# Altium schematic sheet ZIF_Bridge.SchDoc: Ribbon Bridge
size A4; Organization: Altium Limited; Address1: L3, 12a Rodborough Rd; Address2: Frenchs Forest; Address3: NSW; Address4: Australia 2086
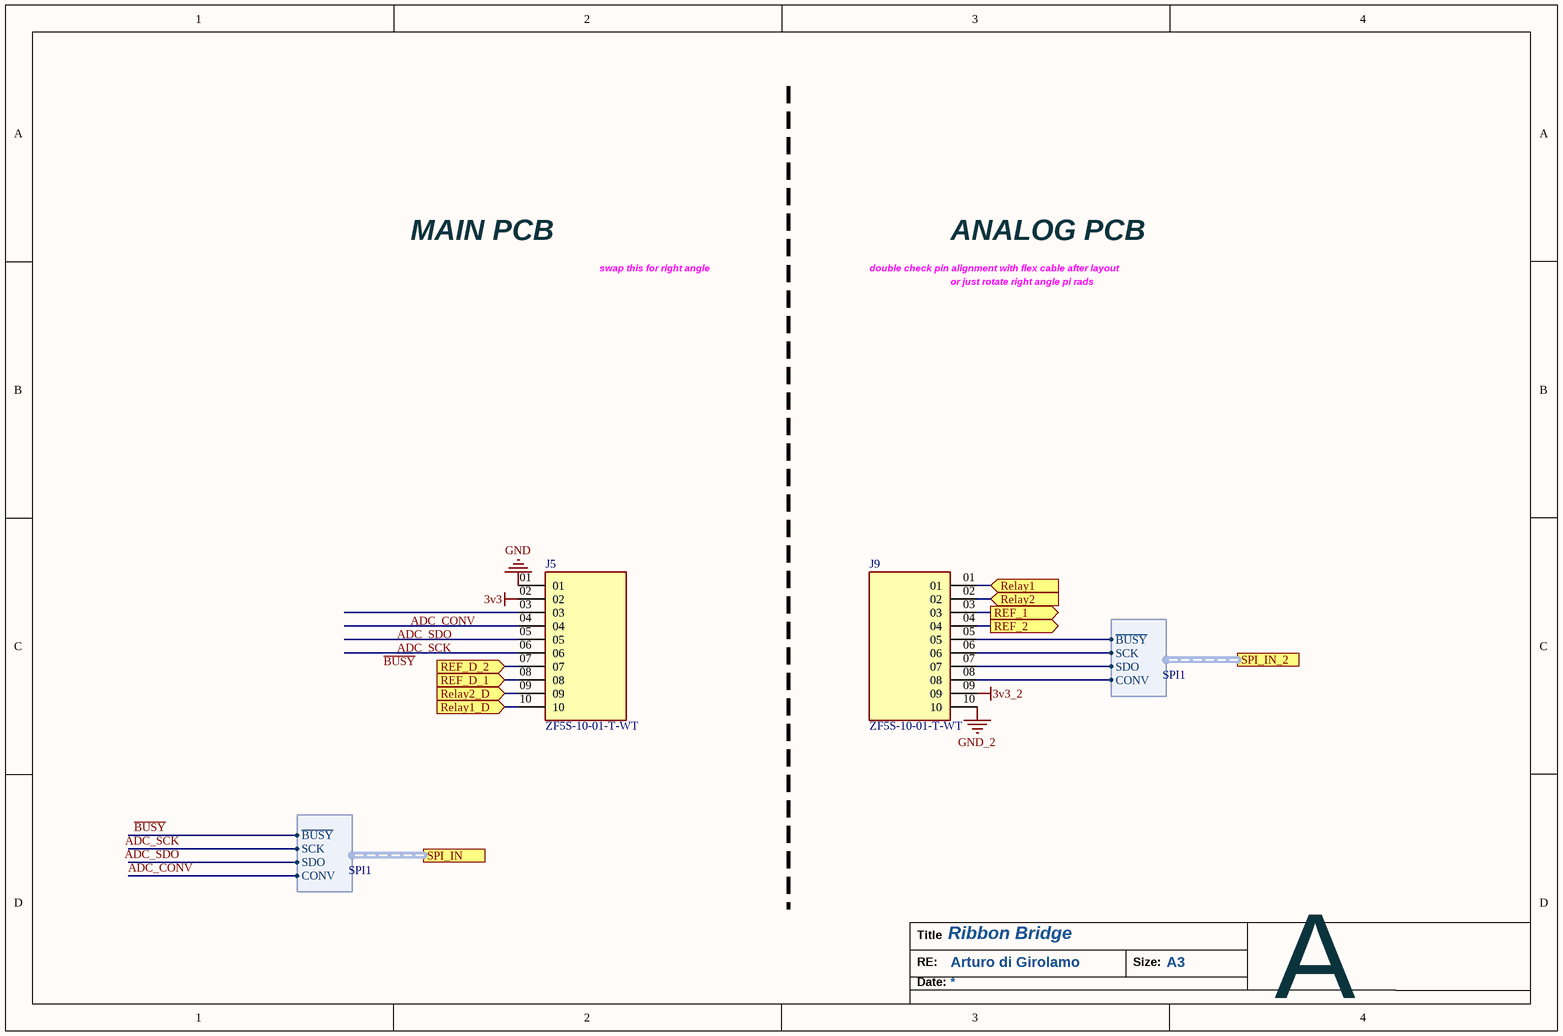
[diagram p0: ZIF_Bridge.SchDoc]

## Parts
J5  ZF5S-10-01-T-WT  [SAMTEC_ZF5S-10-01-T-WT]
J9  ZF5S-10-01-T-WT  [SAMTEC_ZF5S-10-01-T-WT]

## Ports
REF_1 (out), REF_2 (out), REF_D_1 (in), REF_D_2 (in), Relay1 (in), Relay1_D (in), Relay2 (in), Relay2_D (in), SPI_IN (harness SPI1), SPI_IN_2 (harness SPI1)

## Harnesses
SPI1: ~{BUSY}, SCK, CONV, SDO

## Nets
3v3: J5.02
3v3_2: J9.09
GND: J5.01
GND_2: J9.10
ADC_CONV: J5.03 ; port SPI_IN.CONV
ADC_SCK: J5.05 ; port SPI_IN.SCK
ADC_SDO: J5.04 ; port SPI_IN.SDO
~{BUSY}: J5.06 ; port SPI_IN.~{BUSY}
REF_1: J9.03 ; port REF_1
REF_2: J9.04 ; port REF_2
REF_D_1: J5.08 ; port REF_D_1
REF_D_2: J5.07 ; port REF_D_2
Relay1: J9.01 ; port Relay1
Relay1_D: J5.10 ; port Relay1_D
Relay2: J9.02 ; port Relay2
Relay2_D: J5.09 ; port Relay2_D
NetJ9_05: J9.05 ; port SPI_IN_2.~{BUSY}
NetJ9_06: J9.06 ; port SPI_IN_2.SCK
NetJ9_07: J9.07 ; port SPI_IN_2.SDO
NetJ9_08: J9.08 ; port SPI_IN_2.CONV

## Notes on the sheet
- MAIN PCB
- ANALOG PCB
- swap this for right angle
- double check pin alignment with flex cable after layout
- or just rotate right angle pi rads
- Title
- Date:
- RE:
- Arturo di Girolamo
- Size:
- A3
- A

## Library data of the parts
J5 J9 = ZF5S-10-01-T-WT: Value: *; Price: None; Availability: Unavailable; MP: ZF5S-10-01-T-WT; Package: None; ASYPN: ZF5S-10-01-T-WT